# EAGLE design ParaBeep V0.1 (EAGLE 9.5.2)
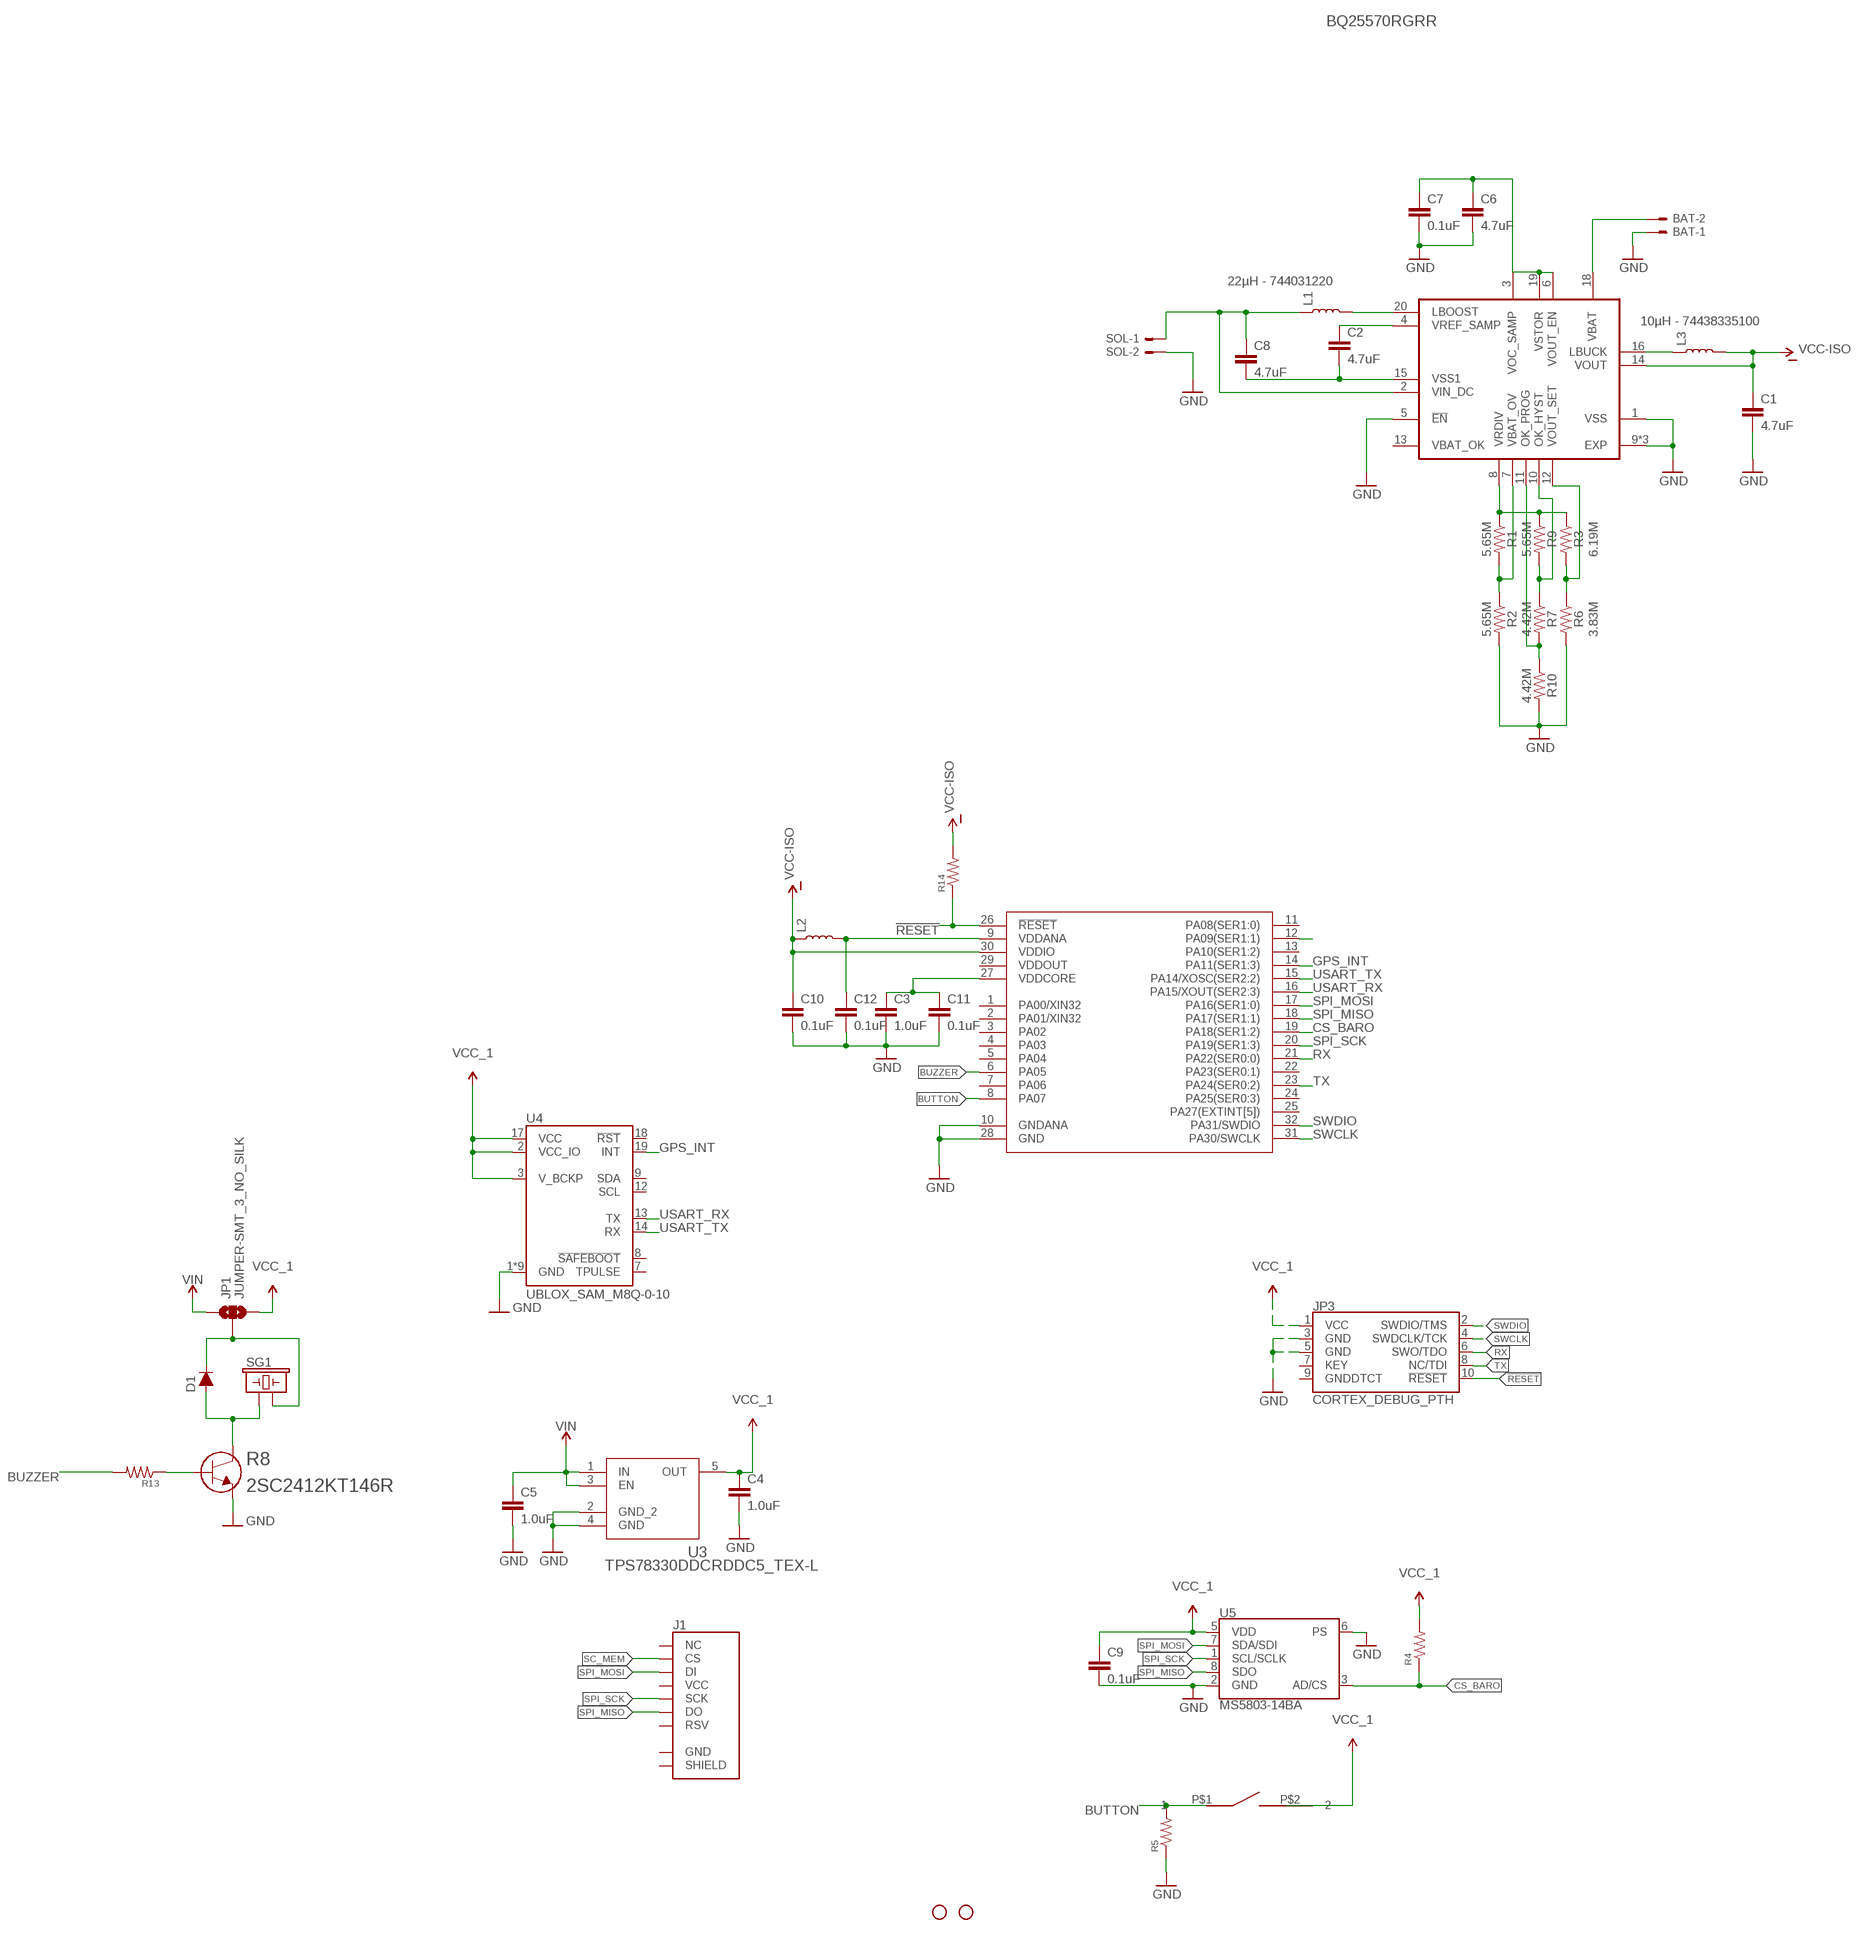
[diagram p0: schematic, sheet 1]

## Parts
BAT  SM02B-SSR-H-TB  [SM02B-SSR-H-TB]
C1  4.7uF  4.7UF-0603-6.3V-(10%)  [0603]
C2  4.7uF  4.7UF-0603-6.3V-(10%)  [0603]
C3  1.0uF  1.0UF-0603-16V-10%  [0603]
C4  1.0uF  1.0UF-0603-16V-10%  [0603]
C5  1.0uF  1.0UF-0603-16V-10%  [0603]
C6  4.7uF  4.7UF-0603-6.3V-(10%)  [0603]
C7  0.1uF  0.1UF-0603-25V-5%  [0603]
C8  4.7uF  4.7UF-0603-6.3V-(10%)  [0603]
C9  0.1uF  0.1UF-0603-25V-(+80/-20%)  [0603]
C10  0.1uF  0.1UF-0603-25V-(+80/-20%)  [0603]
C11  0.1uF  0.1UF-0603-25V-(+80/-20%)  [0603]
C12  0.1uF  0.1UF-0603-25V-(+80/-20%)  [0603]
D1  250mA/100V  DIODE-BAS16J  [SOD-323]
H1  STAND-OFFTIGHT  [STAND-OFF-TIGHT]
H2  STAND-OFFTIGHT  [STAND-OFF-TIGHT]
J1  MICRO-SD_CARD_SOCKETPUSH-PUSH  [MICRO-SD-SOCKET]
JP1  JUMPER-SMT_3_NO_SILK  [SMT-JUMPER_3_NO_SILK]
JP3  CORTEX_DEBUG_PTH  [2X5-PTH-1.27MM]
L1  22µH - 744031220  INDUCTOR-CDRH-4.7UH  [INDUCTOR_4.7UH]
L2  INDUCTORFB-30OHM  [0603]
L3  10µH - 74438335100  INDUCTOR-CDRH-4.7UH  [INDUCTOR_4.7UH]
R1  5.65M  RESISTOR0603  [0603]
R2  5.65M  RESISTOR0603  [0603]
R3  6.19M  RESISTOR0603  [0603]
R4  RESISTOR0402  [0402]
R5  RESISTOR0402  [0402]
R6  3.83M  RESISTOR0603  [0603]
R7  4.42M  RESISTOR0603  [0603]
R8  2SC2412KT146R  [TRANS_2SB852K_ROM]
R9  5.65M  RESISTOR0603  [0603]
R10  4.42M  RESISTOR0603  [0603]
R13  RESISTOR0402  [0402]
R14  RESISTOR0402  [0402]
SG1  BUZZER-SMD_KIT  [BUZZER-CCV-KIT]
SOL  SM02B-SSR-H-TB  [SM02B-SSR-H-TB]
U2  BQ25570RGRR  [QFN50P350X350X100-21N]
U3  TPS78330DDCRDDC5_TEX-L  [DDC5_TEX-L]
U4  UBLOX_SAM_M8Q-0-10  [SAM-M8Q]
U5  MS5803-14BA  [MS5803]
U6  ATSAML10E16A-AFTTQFP32_MC_MCH-L  [TQFP32_MC_MCH-L]
U$3  AB11AH-HC  [AB11AH-HC]

## Nets
!RESET: JP3.10(!RESET) R14.1 U6.26(!RESET)
BUTTON: R5.2 U6.8(PA07) U$3.P$1
BUZZER: R13.2 U6.6(PA05)
CS_BARO: R4.1 U5.3(AD/CS) U6.19(PA18(SER1:2))
GND: BAT.1 C1.2 C3.2 C4.2 C5.2 C6.2 C7.2 C9.2 C10.2 C11.2 C12.2 JP3.3(GND) JP3.5(GND) R2.2 R5.1 R6.2 R8.3(EMITTER) R10.2 SOL.2 U2.1(VSS) U2.5(!EN) U2.9(EXP) U2.17(EXP) U2.21(EXP) U3.2(GND_2) U3.4(GND) U4.1(GND) U4.4(GND) U4.5(GND) U4.6(GND) U4.10(GND) U4.11(GND) U4.15(GND) U4.16(GND) U4.20(GND) U5.2(GND) U5.6(PS) U6.10(GNDANA) U6.28(GND)
GPS_INT: U4.19(INT) U6.14(PA11(SER1:3))
N$1: C3.1 C11.1 U6.27(VDDCORE)
N$2: D1.C JP1.2 SG1.-
N$3: R1.1 R3.1 R9.1 U2.8(VRDIV)
N$4: C2.1 U2.4(VREF_SAMP)
N$5: R7.2 R10.1 U2.11(OK_PROG)
N$6: R3.2 R6.1 U2.12(VOUT_SET)
N$7: R7.1 R9.2 U2.10(OK_HYST)
N$8: R1.2 R2.1 U2.7(VBAT_OV)
N$9: C2.2 C8.2 U2.15(VSS1)
N$10: D1.A R8.1(COLLECTOR) SG1.+
N$11: C8.1 L1.P$1 SOL.1 U2.2(VIN_DC)
N$12: L3.P$1 U2.16(LBUCK)
N$13: R8.2(BASE) R13.1
N$14: U6.12(PA09(SER1:1))
N$15: L1.P$2 U2.20(LBOOST)
N$16: C6.1 C7.1 U2.3(VOC_SAMP) U2.6(VOUT_EN) U2.19(VSTOR)
N$18: C12.1 L2.2 U6.9(VDDANA)
N$21: BAT.2 U2.18(VBAT)
RX: JP3.6(SWO/TDO) U6.21(PA22(SER0:0))
SC_MEM: J1.CS
SPI_MISO: J1.DO U5.8(SDO) U6.18(PA17(SER1:1))
SPI_MOSI: J1.DI U5.7(SDA/SDI) U6.17(PA16(SER1:0))
SPI_SCK: J1.SCLK(SCK) U5.1(SCL/SCLK) U6.20(PA19(SER1:3))
SWCLK: JP3.4(SWDCLK/TCK) U6.31(PA30/SWCLK)
SWDIO: JP3.2(SWDIO/TMS) U6.32(PA31/SWDIO)
TX: JP3.8(NC/TDI) U6.23(PA24(SER0:2))
USART_RX: U4.13(TX) U6.16(PA15/XOUT(SER2:3))
USART_TX: U4.14(RX) U6.15(PA14/XOSC(SER2:2))
VCC-ISO: C1.1 C10.1 L2.1 L3.P$2 R14.2 U2.14(VOUT) U6.30(VDDIO)
VCC_1: C4.1 C9.1 JP1.3 JP3.1(VCC) R4.2 U3.5(OUT) U4.2(VCC_IO) U4.3(V_BCKP) U4.17(VCC) U5.5(VDD) U$3.P$2
VIN: C5.1 JP1.1 U3.1(IN) U3.3(EN)
Unconnected: J1.CD1(SHIELD) J1.GND J1.RSV1(RSV) J1.RSV2(NC) J1.VCC JP3.7(KEY) JP3.9(GNDDTCT) U2.13(VBAT_OK) U4.7(TPULSE) U4.8(!SAFEBOOT) U4.9(SDA) U4.12(SCL) U4.18(!RST) U6.1(PA00/XIN32) U6.2(PA01/XIN32) U6.3(PA02) U6.4(PA03) U6.5(PA04) U6.7(PA06) U6.11(PA08(SER1:0)) U6.13(PA10(SER1:2)) U6.22(PA23(SER0:1)) U6.24(PA25(SER0:3)) U6.25(PA27(EXTINT[5])) U6.29(VDDOUT)

## Library data of the parts
BAT SOL = con-jst2:SM02B-SSR-H-TB: Disconnectable Insulation displacement connector, 1.0mm pitch 2 contacts
C1 C2 C6 C8 = SparkFun-Capacitors:4.7UF: 4.7µF ceramic capacitors A capacitor is a passive two-terminal electrical component used to store electrical energy temporarily in an electric field.; PROD_ID: CAP-08280
C3-C5 = SparkFun-Capacitors:1.0UF: 1µF ceramic capacitors A capacitor is a passive two-terminal electrical component used to store electrical energy temporarily in an electric field.; PROD_ID: CAP-00868
C7 = SparkFun-Capacitors:0.1UF: 0.1µF ceramic capacitors A capacitor is a passive two-terminal electrical component used to store electrical energy temporarily in an electric field.; PROD_ID: CAP-08604
C9-C12 = SparkFun-Capacitors:0.1UF: 0.1µF ceramic capacitors A capacitor is a passive two-terminal electrical component used to store electrical energy temporarily in an electric field.; PROD_ID: CAP-00810
D1 = SparkFun-DiscreteSemi:DIODE: Diode These are standard reverse protection diodes and small signal diodes. SparkFun Products: SparkFun SparkPunk Sound Kit <https://www.sparkfun.com/products/11177> SparkFun ESP8266 Thing <https://www.sparkfun.com/products/13231>; PROD_ID: DIO-09646
H1 H2 = SparkFun-Hardware:STAND-OFF: Stand Off Drill holes for mechanically mounting via screws, standoffs, etc. Note: Use the keepout ring to avoid running the screw head into surrounding components. Variant Overviews STAND-OFF - Mechanical footprint for a #4 phillips button head screw. STAND-OFF-TIGHT - Mechanical footprint for a #4 phillips button head screw, Example SparkFun Products Screw - Phillips Head (1/4", 4-40, 10 pack) <https://www.sparkfun.com/products/10453> (PRT-10453) Screw - Phillips Head (1/2", 4-40, 10 pack) <https://www.sparkfun.com/products/10452> (PRT-10452) Screw - Phillips Head (3/4", 4-40, 10 pack) <https://www.sparkfun.com/products/10451> (PRT-10451) Screw - Phillips Head (1", 4-40, 10 pack) <https://www.sparkfun.com/products/10450> (PRT-10450)
J1 = SparkFun-Connectors:MICRO-SD_CARD_SOCKET: microSD Socket for Transflash Push-push type µSD socket. tDoc lines correctly indicate media card edge positions when inserting (unlocked, locked, depressed). NOTE: CD1 and CD2 are connected internally, and the default detect state of the socket is detect pin to ground. SparkFun Products: WAV Trigger <https://www.sparkfun.com/products/13660> CAN-Bus Shield <https://www.sparkfun.com/products/13262> SparkFun Level Shifing microSD Breakout <https://www.sparkfun.com/products/13743>; PROD_ID: CONN-07820
JP1 = SparkFun-Jumpers:JUMPER-SMT_3_NO: Normally open jumper This jumper has three pads in close proximity to each other. Apply solder to close the connection(s).
JP3 = SparkFun-Connectors:CORTEX_DEBUG: Cortex Debug Connector - 10 pin Supports JTAG debug, Serial Wire debug, and Serial Wire Viewer. PTH and SMD connector options available. General Connector Information <http://infocenter.arm.com/help/topic/com.arm.doc.faqs/attached/13634/cortex_debug_connectors.pdf> Products: PTH Connector <http://www.digikey.com/product-detail/en/cnc-tech/3220-10-0100-00/1175-1627-ND/3883661> -via Digi-Key SparkFun PSoc <https://www.sparkfun.com/products/13229> SparkFun T <https://www.sparkfun.com/products/13810>
L1 L3 = SparkFun-Coils:INDUCTOR: Inductors Resist changes in electrical current. Basically a coil of wire. SparkFun Products: SparkFun Load Cell Amplifier - HX711 <https://www.sparkfun.com/products/13879> IOIO-OTG - V2.2 <https://www.sparkfun.com/products/13613>; PROD_ID: NDUC-10146; VALUE: 4.7µH/±30%/1.2A
L2 = SparkFun-Coils:INDUCTOR: Inductors Resist changes in electrical current. Basically a coil of wire. SparkFun Products: SparkFun Load Cell Amplifier - HX711 <https://www.sparkfun.com/products/13879> IOIO-OTG - V2.2 <https://www.sparkfun.com/products/13613>; PROD_ID: NDUC-07859
R1-R7 R9 R10 R13 R14 = SparkFun-Resistors:RESISTOR: Generic Resistor Package
R8 = 2SC2412KT146R:2SC2412KT146R; BUILT_BY: EMA_Matt; COPYRIGHT: Copyright (C) 2018 Accelerated Designs. All rights reserved; MANUFACTURER_PART_NUMBER: 2SC2412KT146R; SOURCELIBRARY: Rohm_2019-09-23; VENDOR: ROHM Semiconductor
SG1 = SparkFun-Electromechanical:BUZZER: Buzzer Small round buzzers that operate around the audible 2kHz range. You can use these as speakers to create simple music or user interfaces. Variant Overview: PTH - Mini Speaker - PC Mount 12mm 2.048kHz <https://www.sparkfun.com/products/7950> PTH_KIT - Mini Speaker - PC Mount 12mm 2.048kHz <https://www.sparkfun.com/products/7950> KIT simplifies soldering by adding stop mask to one side of the pads. PTH_NO_SILK - Mini Speaker - PC Mount 12mm 2.048kHz <https://www.sparkfun.com/products/7950> No silkscreen indicator of buzzer outline. PTH_KIT_NO_SILK - Mini Speaker - PC Mount 12mm 2.048kHz <https://www.sparkfun.com/products/7950> KIT package w/o silkscreen SMD - Buzzer Audio Magnetic (CCV-084B16) SMD buzzer used on, e.g. the LilyPad Buzzer <https://www.sparkfun.com/products/8463> and RFID USB Reader <https://www.sparkfun.com/products/9963>. SMD_KIT - Buzzer Audio Magnetic (CCV-084B16) SMD Buzzer with elongated pins to make soldering easier. Used on the SparkFun Simon Says - Surface Mount Soldering Kit <https://www.sparkfun.com/products/10935>.; PROD_ID: COMP-08568
U2 = BQ25570RGRR:BQ25570RGRR; DESCRIPTION: Ultra Low power Harvester power Management IC with boost charger, and Nanopower Buck Converter 20-VQFN -40 to 125; DIGI-KEY_PART_NUMBER: 296-39934-1-ND; MF: Texas Instruments; MP: BQ25570RGRR; PACKAGE: VQFN-20 Texas Instruments; PURCHASE-URL: https://pricing.snapeda.com/search/part/BQ25570RGRR/?ref=eda
U3 = TPS78330DDCR:TPS78330DDCR; BUILT_BY: EMA_UL_Team; MANUFACTURER: Texas Instruments; MANUFACTURER_PART_NUMBER: TPS78330DDCR; SOURCELIBRARY: TI_2014-06-19; VENDOR: Texas Instruments
U4 = SparkFun-GPS:UBLOX_SAM_M8Q-0-10: u-blox SAM-M8Q The u-blox concurrent SAM-M8Q GNSS patch antenna module benefits from the exceptional performance of the u-blox M8 multi-GNSS engine. The SAM-M8Q module offers high sensitivity and minimal acquisition times in an ultra compact form factor. The SAM-M8Q module utilizes concurrent reception of up to three GNSS systems (GPS/Galileo and GLONASS), recognizes multiple constellations simultaneously and provides outstanding positioning accuracy in scenarios where urban canyon or weak signals are involved. For even better and faster positioning improvement, the SAM-M8Q supports augmentation of QZSS, GAGAN and IMES together with WAAS, EGNOS, MSAS. The SAM-M8Q also supports message integrity protection, geofencing, and spoofing detection with configurable interface settings to easily fit to customer applications.; PROD_ID: IC-14070
U5 = SparkFun-Sensors:MS5803-14BA: Measurement Specialties MS5803_14BA Pressure (Depth) Sensor The MS5803-14BA is a new generation of high resolution pressure sensors with SPI and I2C bus interface. It is optimized for depth measurement systems with a water depth resolution of 1cm and below. The sensor module includes a high linear pressure sensor and an ultra low power 24 bit ΔΣ ADC with internal factory calibrated coefficients. It provides a precise digital 24 Bit pressure and temperature value and different operation modes that allow the user to optimize for conversion speed and current consumption. Datasheet <https://cdn.sparkfun.com/datasheets/Sensors/Weather/ms5803_14ba.pdf> SparkFun Products SparkFun Pressure Sensor Breakout - MS5803-14BA <https://www.sparkfun.com/products/12909> (SEN-12909); PROD_ID: IC-12111
U6 = ATSAML10E16A-AFT:ATSAML10E16A-AFT; BUILT_BY: EMA_Molly; COPYRIGHT: Copyright (C) 2018 Accelerated Designs. All rights reserved; MANUFACTURER_PART_NUMBER: ATSAML10E16A-AFT; SOURCELIBRARY: Microchip_2019-08-23_25; VENDOR: Microchip
U$3 = AB11AH-HC:AB11AH-HC

## Board
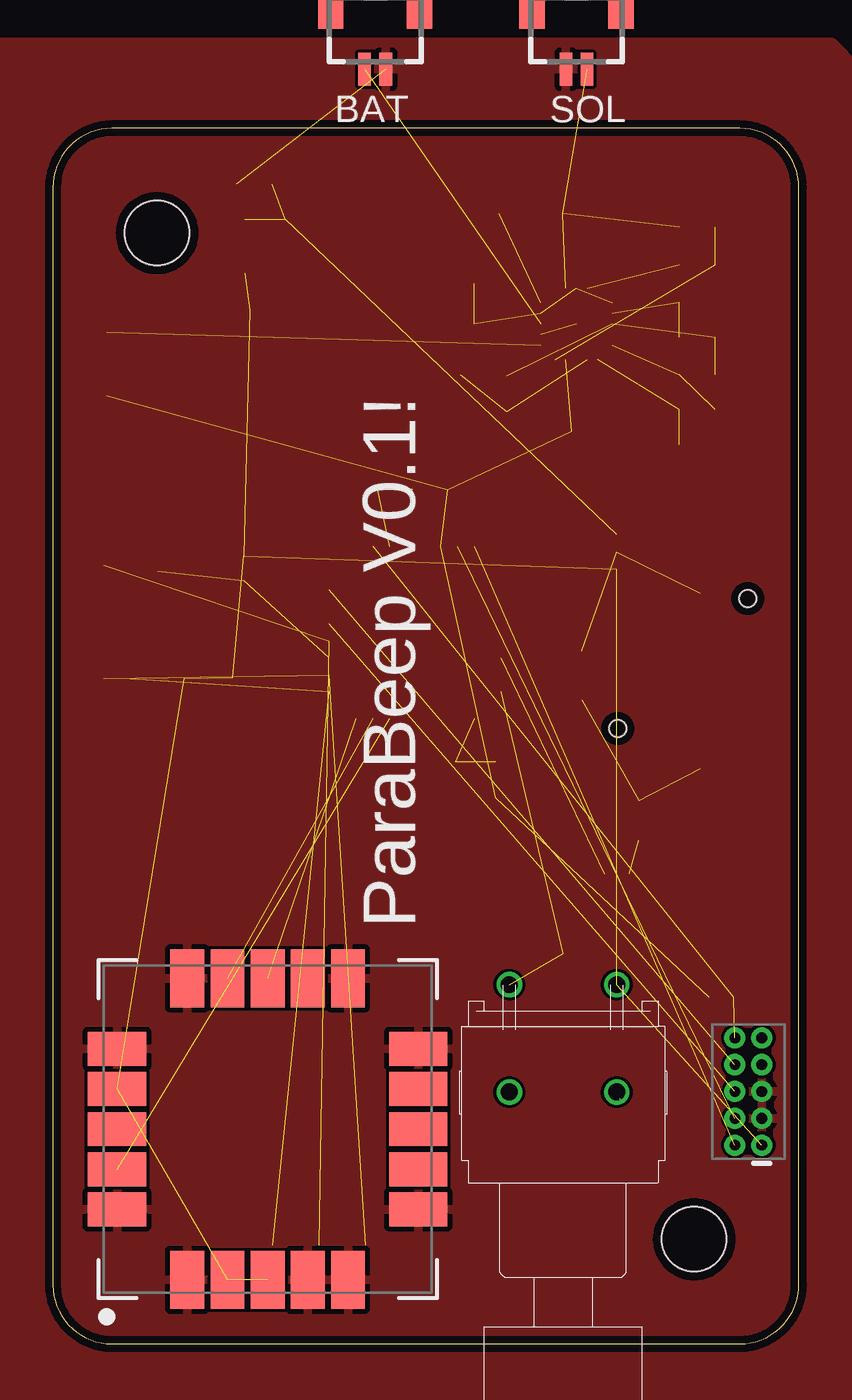
[diagram p1: board, top side]
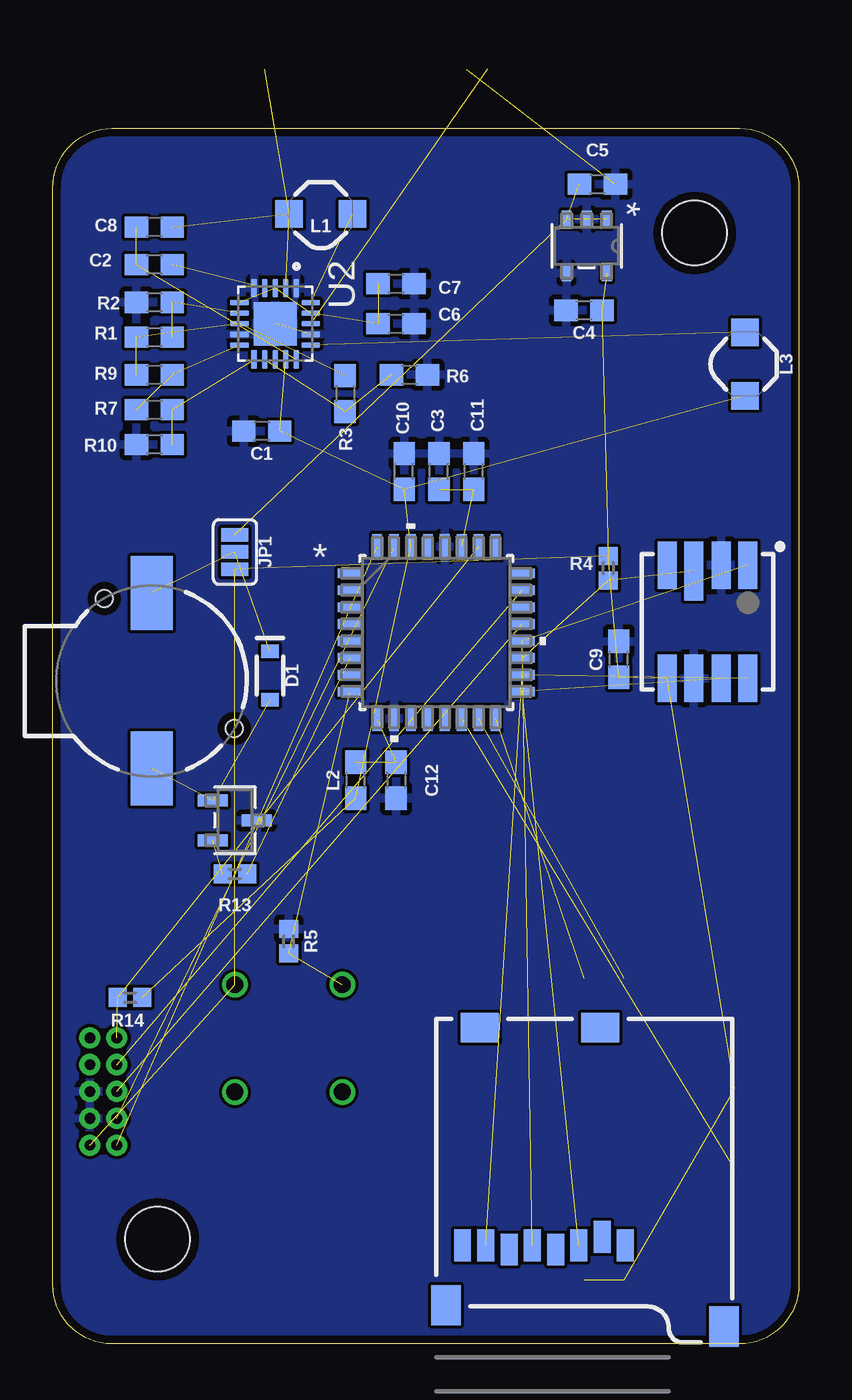
[diagram p2: board, bottom side, seen from below]

Size 35.28 x 57.51 mm. Coordinates in mm from the lower left corner, seen from the top.
Outline: 0,54.71 0,2.79 arc90 2.79,0 32.49,0 arc90 35.28,2.79 35.28,54.71 arc90 32.49,57.51 2.79,57.51 arc90 0,54.71
Copper layers (1*16): Top 0.035559375mm / dielectric 1.6mm / Bottom 0.035559375mm
Design rules "oshpark-2layer *": minimum track width 6mil, minimum drill 10mil, track to track 6mil, track to pad 6mil, pad to pad 6mil, via to via 6mil, smd to smd 6mil, copper to edge 15mil, drill to drill 6mil, minimum pad ring 5mil, minimum via ring 5mil, stop-mask expansion 2.5mil, vias tented up to drill 30mil, thermal gap 10mil

### Footprints (pad centres in the part's own frame; a part is rotated, then mirrored left to right if it is on the bottom)
SM02B-SSR-H-TB = smd 0.6 x 1.55: 1 -0.5,1.925; 2 0.5,1.925 | smd 1.2 x 1.8: FIT@1 -2.1,-0.9; FIT@2 2.1,-0.9
0603 = smd 1.1 x 1: 1 -0.85,0; 2 0.85,0
SOD-323 = smd 0.63 x 0.83: A 1.15,0; C -1.15,0
STAND-OFF-TIGHT = hole 3.048: 0,0
MICRO-SD-SOCKET = smd 1.8 x 1.4: CD1 -2.05,0.4; CD2 -7.75,0.4 | smd 0.8 x 1.5: CS -7.84,10.3; DI -6.74,10.7; DO -2.34,10.7; GND -3.44,10.9; RSV1 -8.94,10.7; RSV2 -1.24,10.7; SCLK -4.54,10.7; VCC -5.64,10.9 | smd 1.4 x 1.9: GND1 -13.6,14.55; GND3 -0.45,13.55
SMT-JUMPER_3_NO_SILK = smd 0.635 x 1.27: 1 -0.813,0; 2 0,0; 3 0.813,0
2X5-PTH-1.27MM = drill 0.508 pad 1: 1 -2.54,-0.635; 2 -2.54,0.635; 3 -1.27,-0.635; 4 -1.27,0.635; 5 0,-0.635; 6 0,0.635; 7 1.27,-0.635; 8 1.27,0.635; 9 2.54,-0.635; 10 2.54,0.635
INDUCTOR_4.7UH = smd 1.3 x 1.3: P$1 -1.5,0; P$2 1.5,0
0402 = smd 0.85 x 0.9: 1 -0.58,0; 2 0.58,0
TRANS_2SB852K_ROM = smd 0.559 x 1.422: 1 -0.95,-1.041; 2 0.95,-1.041; 3 0,1.041
BUZZER-CCV-KIT = smd 3.5 x 2: + 4.15,0; - -4.15,0 | hole 0.8: -3.9,-2.25; 2.25,3.9
QFN50P350X350X100-21N = smd 0.88 x 0.26: 1 -1.685,1; 2 -1.685,0.5; 3 -1.685,0; 4 -1.685,-0.5; 5 -1.685,-1; 11 1.685,-1; 12 1.685,-0.5; 13 1.685,0; 14 1.685,0.5; 15 1.685,1 | smd 0.26 x 0.88: 6 -1,-1.685; 7 -0.5,-1.685; 8 0,-1.685; 9 0.5,-1.685; 10 1,-1.685; 16 1,1.685; 17 0.5,1.685; 18 0,1.685; 19 -0.5,1.685; 20 -1,1.685 | smd 2.05 x 2.05: 21 0,0
DDC5_TEX-L = smd 0.8 x 0.457: 1 -1.276,0.95; 2 -1.276,0; 3 -1.276,-0.95; 4 1.276,-0.95; 5 1.276,0.95
SAM-M8Q = smd 2.75 x 1.6: 1 -7.125,3.8; 2 -7.125,1.9; 3 -7.125,0; 4 -7.125,-1.9; 5 -7.125,-3.8; 11 7.125,-3.8; 12 7.125,-1.9; 13 7.125,0; 14 7.125,1.9; 15 7.125,3.8 | smd 1.6 x 2.75: 6 -3.8,-7.125; 7 -1.9,-7.125; 8 0,-7.125; 9 1.9,-7.125; 10 3.8,-7.125; 16 3.8,7.125; 17 1.9,7.125; 18 0,7.125; 19 -1.9,7.125; 20 -3.8,7.125
MS5803 = smd 2.25 x 0.9: 1 -2.675,1.9; 2 -2.675,0.65; 4 -2.675,-1.9; 5 2.675,-1.9; 6 2.675,-0.65; 7 2.675,0.65; 8 2.675,1.9 | smd 2.8 x 0.9: 3 -2.4,-0.65
TQFP32_MC_MCH-L = smd 1.168 x 0.457: 1 -4.068,2.8; 2 -4.068,2; 3 -4.068,1.2; 4 -4.068,0.4; 5 -4.068,-0.4; 6 -4.068,-1.2; 7 -4.068,-2; 8 -4.068,-2.8; 17 4.068,-2.8; 18 4.068,-2; 19 4.068,-1.2; 20 4.068,-0.4; 21 4.068,0.4; 22 4.068,1.2; 23 4.068,2; 24 4.068,2.8 | smd 0.457 x 1.168: 9 -2.8,-4.068; 10 -2,-4.068; 11 -1.2,-4.068; 12 -0.4,-4.068; 13 0.4,-4.068; 14 1.2,-4.068; 15 2,-4.068; 16 2.8,-4.068; 25 2.8,4.068; 26 2,4.068; 27 1.2,4.068; 28 0.4,4.068; 29 -0.4,4.068; 30 -1.2,4.068; 31 -2,4.068; 32 -2.8,4.068
AB11AH-HC = drill 0.8: P$1 -2.54,9.373; P$2 2.54,9.373; P$3 -2.54,4.293; P$4 2.54,4.293

### Placement (x,y rotation side)
BAT  15.24,62.23 180 top
C1  25.4,43.18 180 bottom
C2  30.48,51.05 180 bottom
C3  17.02,41.27 90 bottom
C4  10.16,48.9 180 bottom
C5  9.53,54.86 0 bottom
C6  19.05,48.26 0 bottom
C7  19.05,50.16 0 bottom
C8  30.48,52.83 180 bottom
C9  8.51,32.38 90 bottom
C10  18.67,41.27 90 bottom
C11  15.37,41.27 90 bottom
C12  19.05,26.67 270 bottom
D1  25.02,31.62 270 bottom
H1  4.93,52.55 0 top
H2  30.33,4.95 0 top
J1  17.14,15.37 180 bottom
JP1  26.67,37.47 270 bottom
JP3  32.89,11.94 90 top
L1  22.61,53.47 0 bottom
L2  20.95,26.67 90 bottom
L3  2.54,46.35 270 bottom
R1  30.48,47.62 0 bottom
R2  30.48,49.28 180 bottom
R3  21.46,44.96 270 bottom
R4  9.02,36.7 90 bottom
R5  24.13,19.05 270 bottom
R6  18.41,45.85 0 bottom
R7  30.48,44.2 0 bottom
R8  26.67,24.77 270 bottom
R9  30.48,45.85 0 bottom
R10  30.48,42.55 180 bottom
R13  26.67,22.23 0 bottom
R14  31.62,16.38 0 bottom
SG1  30.61,31.37 270 bottom
SOL  24.77,62.23 180 top
U2  24.77,48.26 270 bottom
U3  10.03,51.94 270 bottom
U4  10.16,10.16 90 top
U5  4.32,34.16 270 bottom
U6  17.14,33.66 0 bottom
U$3  24.13,7.62 0 top

### Tracks (layer width: path | path; a pad name or v marks a point on that pad's centre or on a via)
!RESET  (2 unrouted)
BUTTON  (2 unrouted)
BUZZER  (1 unrouted)
CS_BARO  (2 unrouted)
GND  (2 unrouted)
  pour Bottom: -5.08,-4.45 -5.08,60.33 38.1,60.33 38.1,-5.08 -4.45,-5.08
  pour Top: -5.08,-5.71 -5.08,60.96 -4.45,61.59 36.83,61.59 38.1,60.33 38.1,-5.08 37.47,-5.71
GPS_INT  (1 unrouted)
N$1  (2 unrouted)
N$2  (2 unrouted)
N$3  (3 unrouted)
N$4  (1 unrouted)
N$5  (2 unrouted)
N$6  (2 unrouted)
N$7  (2 unrouted)
N$8  (2 unrouted)
N$9  (2 unrouted)
N$10  (2 unrouted)
N$11  (3 unrouted)
N$12  (1 unrouted)
N$13  (1 unrouted)
N$15  (1 unrouted)
N$16  (4 unrouted)
N$18  (2 unrouted)
N$21  (1 unrouted)
RX  (1 unrouted)
SPI_MISO  (2 unrouted)
SPI_MOSI  (2 unrouted)
SPI_SCK  (2 unrouted)
SWCLK  (1 unrouted)
SWDIO  (1 unrouted)
TX  (1 unrouted)
USART_RX  (1 unrouted)
USART_TX  (1 unrouted)
VCC-ISO  (6 unrouted)
VCC_1  (10 unrouted)
VIN  (3 unrouted)

### Text on the board
tNames: ParaBeep V0.1!